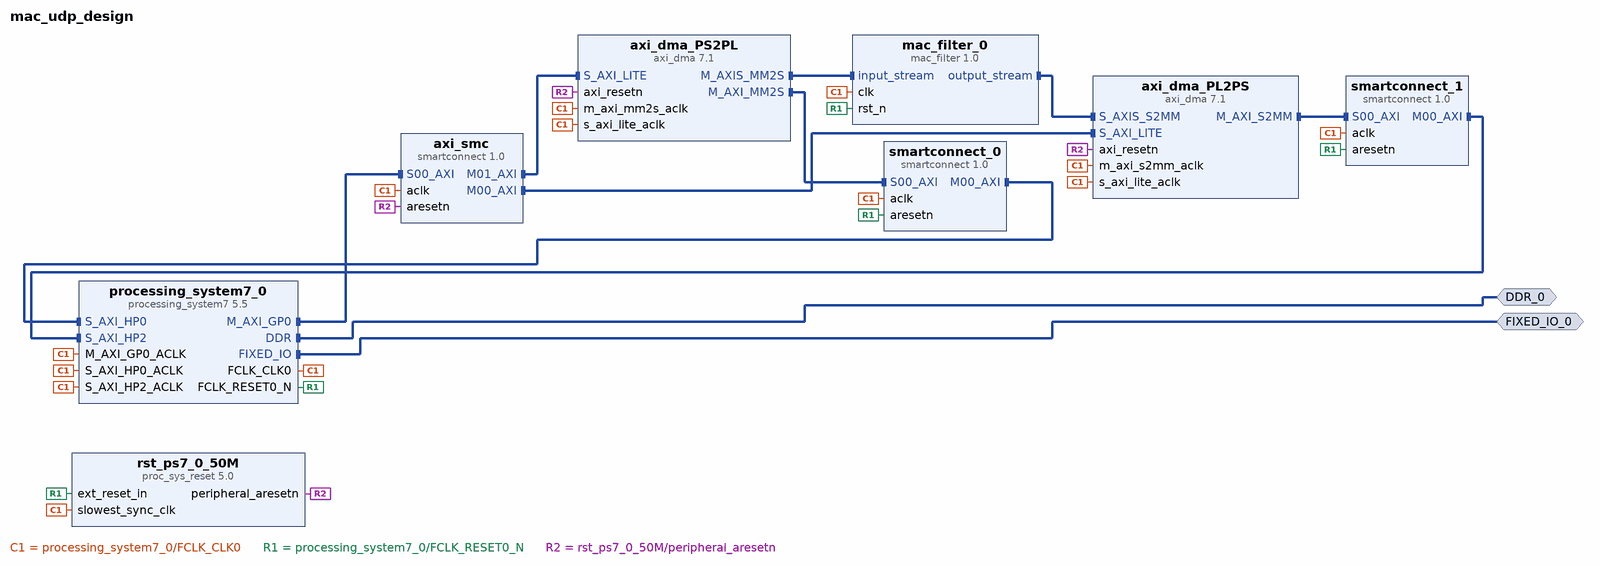
[diagram p0: block diagram of the top level]
# Vivado block design mac_udp_design, xc7z020clg400-1, Vivado 2024.2
create_bd_design mac_udp_design

create_bd_intf_port -mode Master -vlnv xilinx.com:interface:ddrx_rtl:1.0 DDR_0
create_bd_intf_port -mode Master -vlnv xilinx.com:display_processing_system7:fixedio_rtl:1.0 FIXED_IO_0

create_bd_cell -type ip -vlnv xilinx.com:user:mac_filter:1.0 mac_filter_0
create_bd_cell -type ip -vlnv xilinx.com:ip:axi_dma:7.1 axi_dma_PS2PL
set_property -dict [list \
  CONFIG.c_include_mm2s_dre 1 \
  CONFIG.c_include_s2mm 0 \
  CONFIG.c_include_sg 0 \
  CONFIG.c_sg_length_width 22 \
] [get_bd_cells axi_dma_PS2PL]
create_bd_cell -type ip -vlnv xilinx.com:ip:axi_dma:7.1 axi_dma_PL2PS
set_property -dict [list \
  CONFIG.c_include_mm2s 0 \
  CONFIG.c_include_s2mm 1 \
  CONFIG.c_include_s2mm_dre 1 \
  CONFIG.c_include_sg 0 \
  CONFIG.c_sg_length_width 22 \
] [get_bd_cells axi_dma_PL2PS]
create_bd_cell -type ip -vlnv xilinx.com:ip:smartconnect:1.0 smartconnect_0
set_property -dict {CONFIG.NUM_SI 1} [get_bd_cells smartconnect_0]
create_bd_cell -type ip -vlnv xilinx.com:ip:smartconnect:1.0 smartconnect_1
set_property -dict {CONFIG.NUM_SI 1} [get_bd_cells smartconnect_1]
create_bd_cell -type ip -vlnv xilinx.com:ip:processing_system7:5.5 processing_system7_0
set_property -dict [list \
  CONFIG.PCW_S_AXI_HP0_DATA_WIDTH 32 \
  CONFIG.PCW_S_AXI_HP2_DATA_WIDTH 32 \
  CONFIG.PCW_USE_S_AXI_HP0 1 \
  CONFIG.PCW_USE_S_AXI_HP2 1 \
] [get_bd_cells processing_system7_0]
# 1 more settings of processing_system7_0 are not shown: defaults, MIO pin electricals, DDR timing, and values the tool derives
create_bd_cell -type ip -vlnv xilinx.com:ip:smartconnect:1.0 axi_smc
set_property -dict {CONFIG.NUM_MI 2 CONFIG.NUM_SI 1} [get_bd_cells axi_smc]
create_bd_cell -type ip -vlnv xilinx.com:ip:proc_sys_reset:5.0 rst_ps7_0_50M

# ---- connections ----

connect_bd_intf_net [get_bd_intf_pins smartconnect_1/S00_AXI] [get_bd_intf_pins axi_dma_PL2PS/M_AXI_S2MM]
connect_bd_intf_net [get_bd_intf_pins axi_dma_PS2PL/M_AXIS_MM2S] [get_bd_intf_pins mac_filter_0/input_stream]
connect_bd_intf_net [get_bd_intf_pins smartconnect_0/S00_AXI] [get_bd_intf_pins axi_dma_PS2PL/M_AXI_MM2S]
connect_bd_intf_net [get_bd_intf_pins axi_smc/M00_AXI] [get_bd_intf_pins axi_dma_PL2PS/S_AXI_LITE]
connect_bd_intf_net [get_bd_intf_pins axi_smc/M01_AXI] [get_bd_intf_pins axi_dma_PS2PL/S_AXI_LITE]
connect_bd_intf_net [get_bd_intf_pins mac_filter_0/output_stream] [get_bd_intf_pins axi_dma_PL2PS/S_AXIS_S2MM]
connect_bd_intf_net [get_bd_intf_ports DDR_0] [get_bd_intf_pins processing_system7_0/DDR]
connect_bd_intf_net [get_bd_intf_ports FIXED_IO_0] [get_bd_intf_pins processing_system7_0/FIXED_IO]
connect_bd_intf_net [get_bd_intf_pins processing_system7_0/M_AXI_GP0] [get_bd_intf_pins axi_smc/S00_AXI]
connect_bd_intf_net [get_bd_intf_pins smartconnect_0/M00_AXI] [get_bd_intf_pins processing_system7_0/S_AXI_HP0]
connect_bd_intf_net [get_bd_intf_pins processing_system7_0/S_AXI_HP2] [get_bd_intf_pins smartconnect_1/M00_AXI]
connect_bd_net [get_bd_pins processing_system7_0/FCLK_CLK0] \
  [get_bd_pins processing_system7_0/M_AXI_GP0_ACLK] [get_bd_pins axi_dma_PL2PS/m_axi_s2mm_aclk] \
  [get_bd_pins smartconnect_1/aclk] [get_bd_pins axi_dma_PL2PS/s_axi_lite_aclk] [get_bd_pins axi_dma_PS2PL/m_axi_mm2s_aclk] \
  [get_bd_pins smartconnect_0/aclk] [get_bd_pins axi_dma_PS2PL/s_axi_lite_aclk] \
  [get_bd_pins processing_system7_0/S_AXI_HP0_ACLK] [get_bd_pins processing_system7_0/S_AXI_HP2_ACLK] \
  [get_bd_pins axi_smc/aclk] [get_bd_pins rst_ps7_0_50M/slowest_sync_clk] [get_bd_pins mac_filter_0/clk]
connect_bd_net [get_bd_pins processing_system7_0/FCLK_RESET0_N] \
  [get_bd_pins smartconnect_1/aresetn] [get_bd_pins smartconnect_0/aresetn] [get_bd_pins rst_ps7_0_50M/ext_reset_in] \
  [get_bd_pins mac_filter_0/rst_n]
connect_bd_net [get_bd_pins rst_ps7_0_50M/peripheral_aresetn] \
  [get_bd_pins axi_dma_PL2PS/axi_resetn] [get_bd_pins axi_dma_PS2PL/axi_resetn] [get_bd_pins axi_smc/aresetn]

# ---- address map ----
assign_bd_address -offset 0x00000000 -range 512M -target_address_space [get_bd_addr_spaces axi_dma_PL2PS/Data_S2MM] [get_bd_addr_segs processing_system7_0/S_AXI_HP2/HP2_DDR_LOWOCM]
assign_bd_address -offset 0x00000000 -range 512M -target_address_space [get_bd_addr_spaces axi_dma_PS2PL/Data_MM2S] [get_bd_addr_segs processing_system7_0/S_AXI_HP0/HP0_DDR_LOWOCM]
assign_bd_address -offset 0x40400000 -range 64K -target_address_space [get_bd_addr_spaces processing_system7_0/Data] [get_bd_addr_segs axi_dma_PL2PS/S_AXI_LITE/Reg]
assign_bd_address -offset 0x40410000 -range 64K -target_address_space [get_bd_addr_spaces processing_system7_0/Data] [get_bd_addr_segs axi_dma_PS2PL/S_AXI_LITE/Reg]

validate_bd_design
save_bd_design
